# EAGLE design 8-Bit Register (EAGLE 7.5.0)
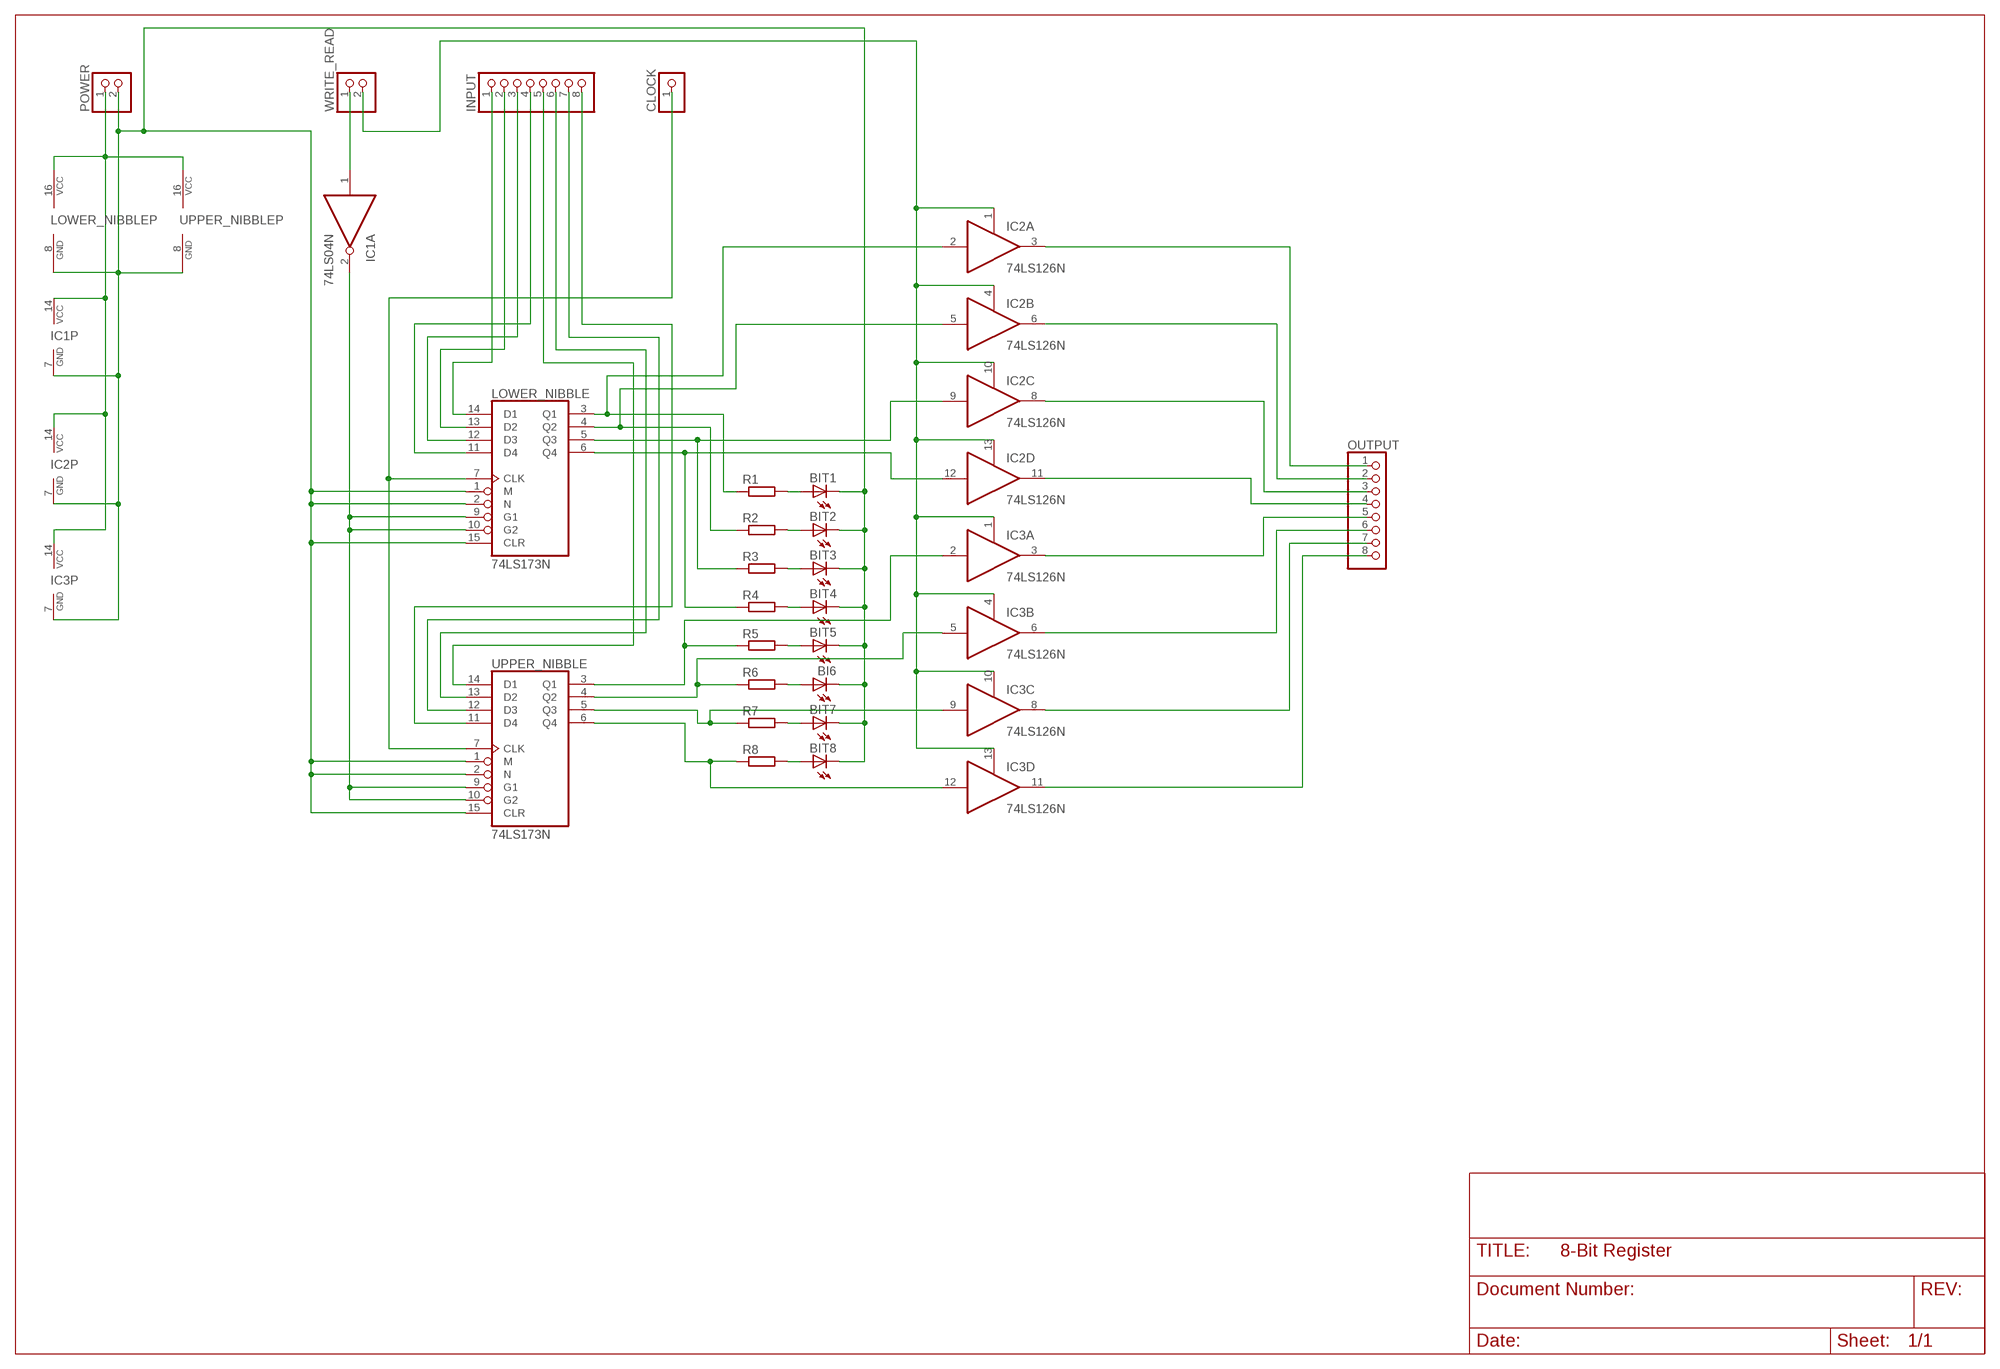
[diagram p0: schematic, sheet 1]

## Parts
BI6  LED3MM  [LED3MM]
BIT1  LED3MM  [LED3MM]
BIT2  LED3MM  [LED3MM]
BIT3  LED3MM  [LED3MM]
BIT4  LED3MM  [LED3MM]
BIT5  LED3MM  [LED3MM]
BIT7  LED3MM  [LED3MM]
BIT8  LED3MM  [LED3MM]
CLOCK  PINHD-1X1  [1X01]
IC1  74LS04N  [DIL14]
IC2  74LS126N  [DIL14]
IC3  74LS126N  [DIL14]
INPUT  PINHD-1X8  [1X08]
LOWER_NIBBLE  74LS173N  [DIL16]
OUTPUT  PINHD-1X8  [1X08]
POWER  PINHD-1X2  [1X02]
R1  R-EU_0207/10  [0207/10]
R2  R-EU_0207/10  [0207/10]
R3  R-EU_0207/10  [0207/10]
R4  R-EU_0207/10  [0207/10]
R5  R-EU_0207/10  [0207/10]
R6  R-EU_0207/10  [0207/10]
R7  R-EU_0207/10  [0207/10]
R8  R-EU_0207/10  [0207/10]
UPPER_NIBBLE  74LS173N  [DIL16]
WRITE_READ  PINHD-1X2  [1X02]

## Nets
GND: BI6.K(C) BIT1.K(C) BIT2.K(C) BIT3.K(C) BIT4.K(C) BIT5.K(C) BIT7.K(C) BIT8.K(C) IC1.7(P:GND) IC2.7(P:GND) IC3.7(P:GND) LOWER_NIBBLE.1(M) LOWER_NIBBLE.2(N) LOWER_NIBBLE.8(GND) LOWER_NIBBLE.15(CLR) POWER.2 UPPER_NIBBLE.1(M) UPPER_NIBBLE.2(N) UPPER_NIBBLE.8(GND) UPPER_NIBBLE.15(CLR)
N$1: BIT8.A R8.2
N$2: IC1.1(A:I) WRITE_READ.1
N$3: BIT1.A R1.2
N$5: BIT2.A R2.2
N$6: BIT3.A R3.2
N$7: BIT4.A R4.2
N$8: BIT5.A R5.2
N$9: BI6.A R6.2
N$10: BIT7.A R7.2
N$11: IC2.11(D:O) OUTPUT.4
N$12: IC1.2(A:O) LOWER_NIBBLE.9(G1) LOWER_NIBBLE.10(G2) UPPER_NIBBLE.9(G1) UPPER_NIBBLE.10(G2)
N$13: CLOCK.1 LOWER_NIBBLE.7(CLK) UPPER_NIBBLE.7(CLK)
N$14: INPUT.1 LOWER_NIBBLE.14(D1)
N$15: INPUT.2 LOWER_NIBBLE.13(D2)
N$16: INPUT.3 LOWER_NIBBLE.12(D3)
N$17: INPUT.4 LOWER_NIBBLE.11(D4)
N$18: INPUT.6 UPPER_NIBBLE.13(D2)
N$19: INPUT.5 UPPER_NIBBLE.14(D1)
N$20: INPUT.7 UPPER_NIBBLE.12(D3)
N$21: INPUT.8 UPPER_NIBBLE.11(D4)
N$22: IC2.2(A:I) LOWER_NIBBLE.3(Q1) R1.1
N$23: IC2.5(B:I) LOWER_NIBBLE.4(Q2) R2.1
N$24: IC2.9(C:I) LOWER_NIBBLE.5(Q3) R3.1
N$25: IC2.12(D:I) LOWER_NIBBLE.6(Q4) R4.1
N$26: IC3.2(A:I) R5.1 UPPER_NIBBLE.3(Q1)
N$27: IC3.5(B:I) R6.1 UPPER_NIBBLE.4(Q2)
N$28: IC3.9(C:I) R7.1 UPPER_NIBBLE.5(Q3)
N$29: IC3.12(D:I) R8.1 UPPER_NIBBLE.6(Q4)
N$30: IC2.1(A:OE) IC2.4(B:OE) IC2.10(C:OE) IC2.13(D:OE) IC3.1(A:OE) IC3.4(B:OE) IC3.10(C:OE) IC3.13(D:OE) WRITE_READ.2
N$31: IC2.3(A:O) OUTPUT.1
N$32: IC2.6(B:O) OUTPUT.2
N$33: IC2.8(C:O) OUTPUT.3
N$35: IC3.3(A:O) OUTPUT.5
N$36: IC3.6(B:O) OUTPUT.6
N$37: IC3.8(C:O) OUTPUT.7
N$38: IC3.11(D:O) OUTPUT.8
VCC: IC1.14(P:VCC) IC2.14(P:VCC) IC3.14(P:VCC) LOWER_NIBBLE.16(VCC) POWER.1 UPPER_NIBBLE.16(VCC)
Unconnected: IC1.3(B:I) IC1.4(B:O) IC1.5(C:I) IC1.6(C:O) IC1.8(D:O) IC1.9(D:I) IC1.10(E:O) IC1.11(E:I) IC1.12(F:O) IC1.13(F:I)

## Library data of the parts
BI6 BIT1-BIT5 BIT7 BIT8 = led:LED: LED OSRAM: - CHIPLED LG R971, LG N971, LY N971, LG Q971, LY Q971, LO R971, LY R971 LH N974, LH R974 LS Q976, LO Q976, LY Q976 LO Q996 - Hyper CHIPLED LW Q18S LB Q993, LB Q99A, LB R99A - SideLED LS A670, LO A670, LY A670, LG A670, LP A670 LB A673, LV A673, LT A673, LW A673 LH A674 LY A675 LS A676, LA A676, LO A676, LY A676, LW A676 LS A679, LY A679, LG A679 - Hyper Micro SIDELED® LS Y876, LA Y876, LO Y876, LY Y876 LT Y87S - SmartLED LW L88C, LW L88S LB L89C, LB L89S, LG L890 LS L89K, LO L89K, LY L89K LS L896, LA L896, LO L896, LY L896 - TOPLED LS T670, LO T670, LY T670, LG T670, LP T670 LSG T670, LSP T670, LSY T670, LOP T670, LYG T670 LG T671, LOG T671, LSG T671 LB T673, LV T673, LT T673, LW T673 LH T674 LS T676, LA T676, LO T676, LY T676, LB T676, LH T676, LSB T676, LW T676 LB T67C, LV T67C, LT T67C, LS T67K, LO T67K, LY T67K, LW E67C LS E67B, LA E67B, LO E67B, LY E67B, LB E67C, LV E67C, LT E67C LW T67C LS T679, LY T679, LG T679 LS T770, LO T770, LY T770, LG T770, LP T770 LB T773, LV T773, LT T773, LW T773 LH T774 LS E675, LA E675, LY E675, LS T675 LS T776, LA T776, LO T776, LY T776, LB T776 LHGB T686 LT T68C, LB T68C - Hyper Mini TOPLED® LB M676 - Mini TOPLED Santana® LG M470 LS M47K, LO M47K, LY M47K Source: http://www.osram.convergy.de LUXEON: - LUMILED® LXK2-PW12-R00, LXK2-PW12-S00, LXK2-PW14-U00, LXK2-PW14-V00 LXK2-PM12-R00, LXK2-PM12-S00, LXK2-PM14-U00 LXK2-PE12-Q00, LXK2-PE12-R00, LXK2-PE12-S00, LXK2-PE14-T00, LXK2-PE14-U00 LXK2-PB12-K00, LXK2-PB12-L00, LXK2-PB12-M00, LXK2-PB14-N00, LXK2-PB14-P00, LXK2-PB14-Q00 LXK2-PR12-L00, LXK2-PR12-M00, LXK2-PR14-Q00, LXK2-PR14-R00 LXK2-PD12-Q00, LXK2-PD12-R00, LXK2-PD12-S00 LXK2-PH12-R00, LXK2-PH12-S00 LXK2-PL12-P00, LXK2-PL12-Q00, LXK2-PL12-R00 Source: www.luxeon.com KINGBRIGHT: KA-3528ASYC Source: www.kingbright.com
CLOCK = pinhead:PINHD-1X1: PIN HEADER
IC1 = 74xx-eu:74*04: Hex INVERTER
IC2 IC3 = 74xx-eu:74*126: Quad bus BUFFER, 3-state
INPUT OUTPUT = pinhead:PINHD-1X8: PIN HEADER
LOWER_NIBBLE UPPER_NIBBLE = 74xx-us:74*173: 4-bit D type REGISTER, 3-state
POWER WRITE_READ = pinhead:PINHD-1X2: PIN HEADER
R1-R8 = resistor:R-EU_: RESISTOR, European symbol

## Board
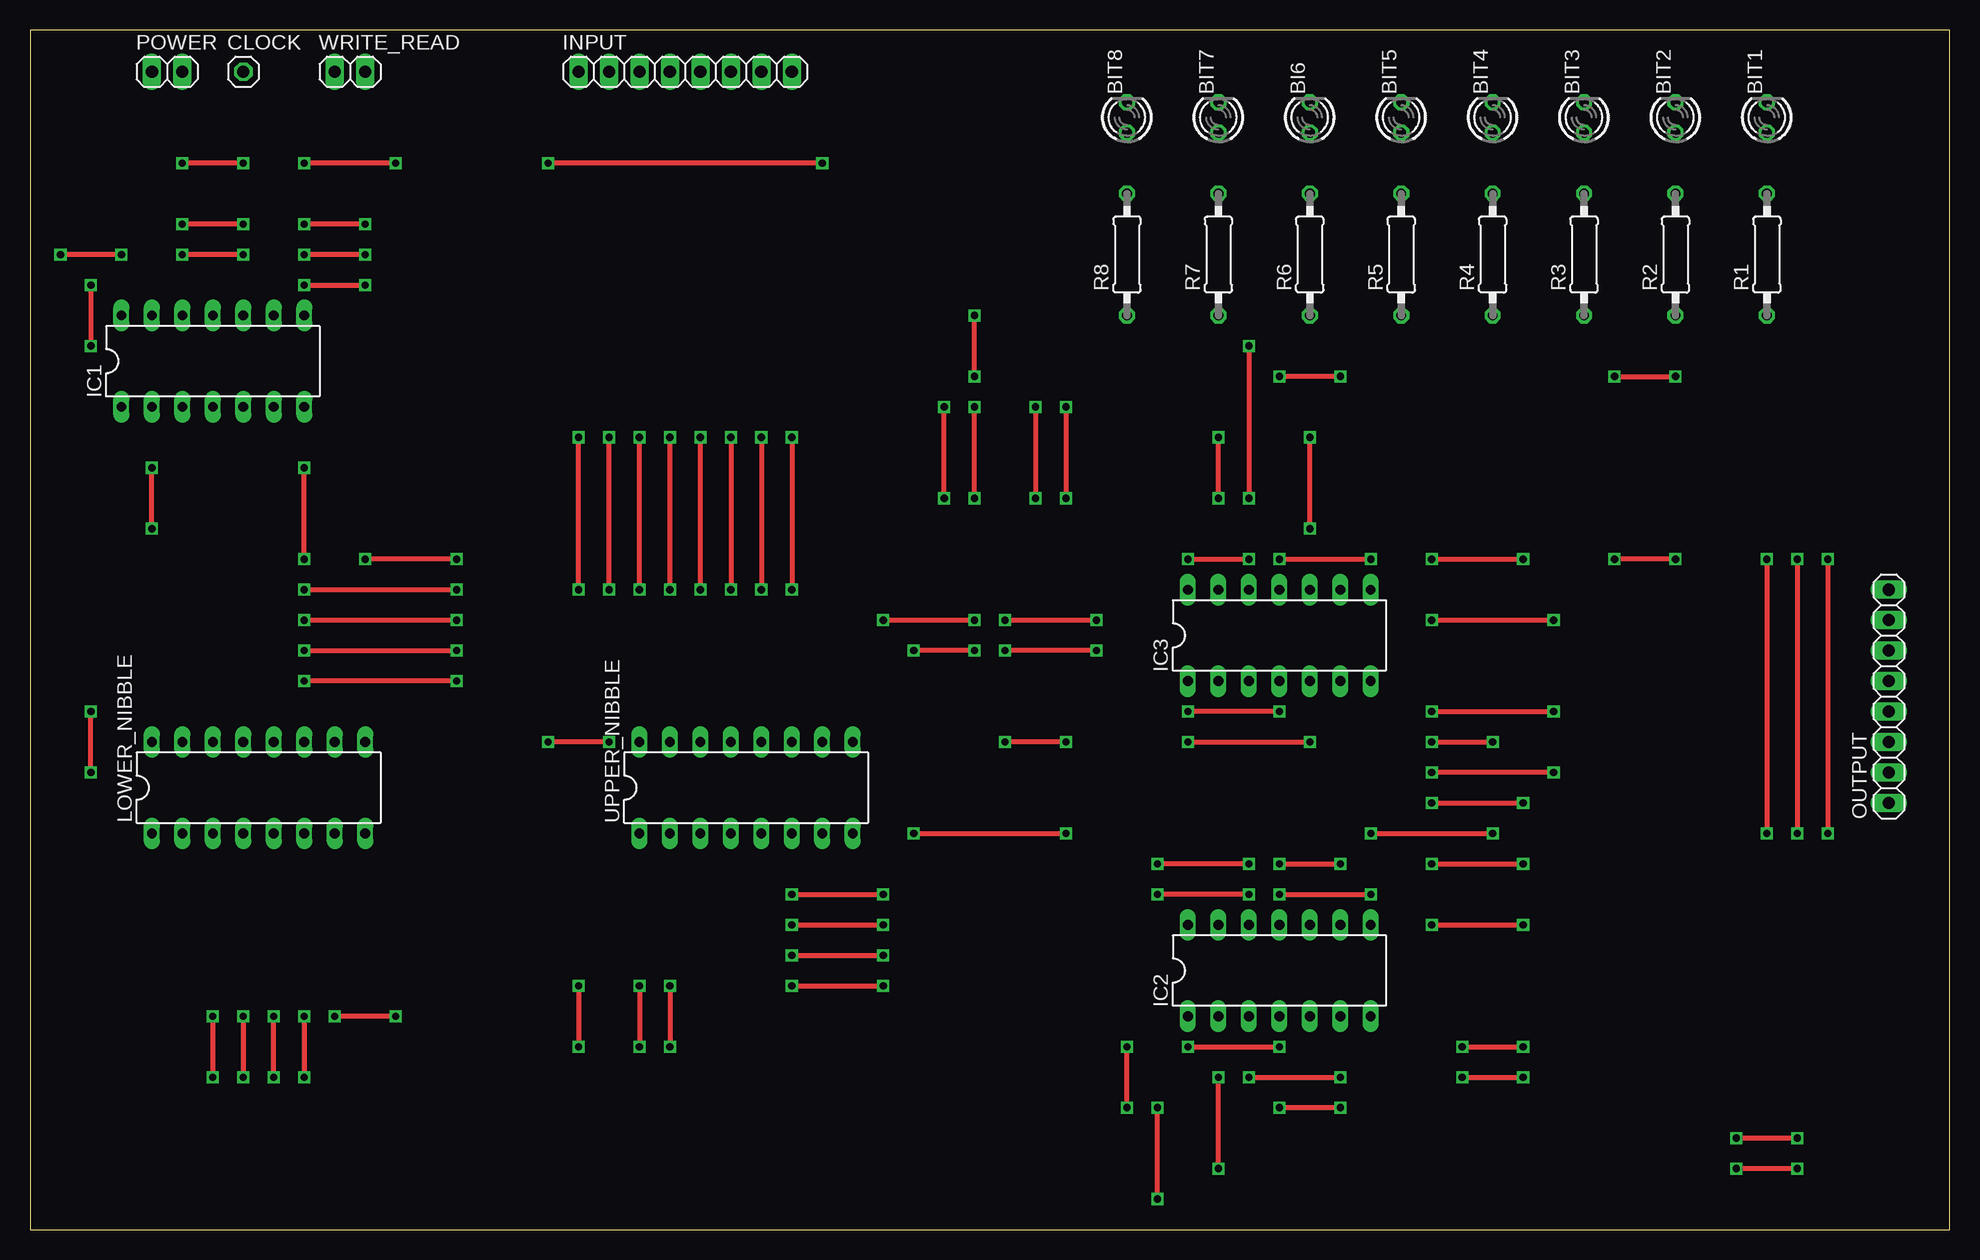
[diagram p1: board, top side]
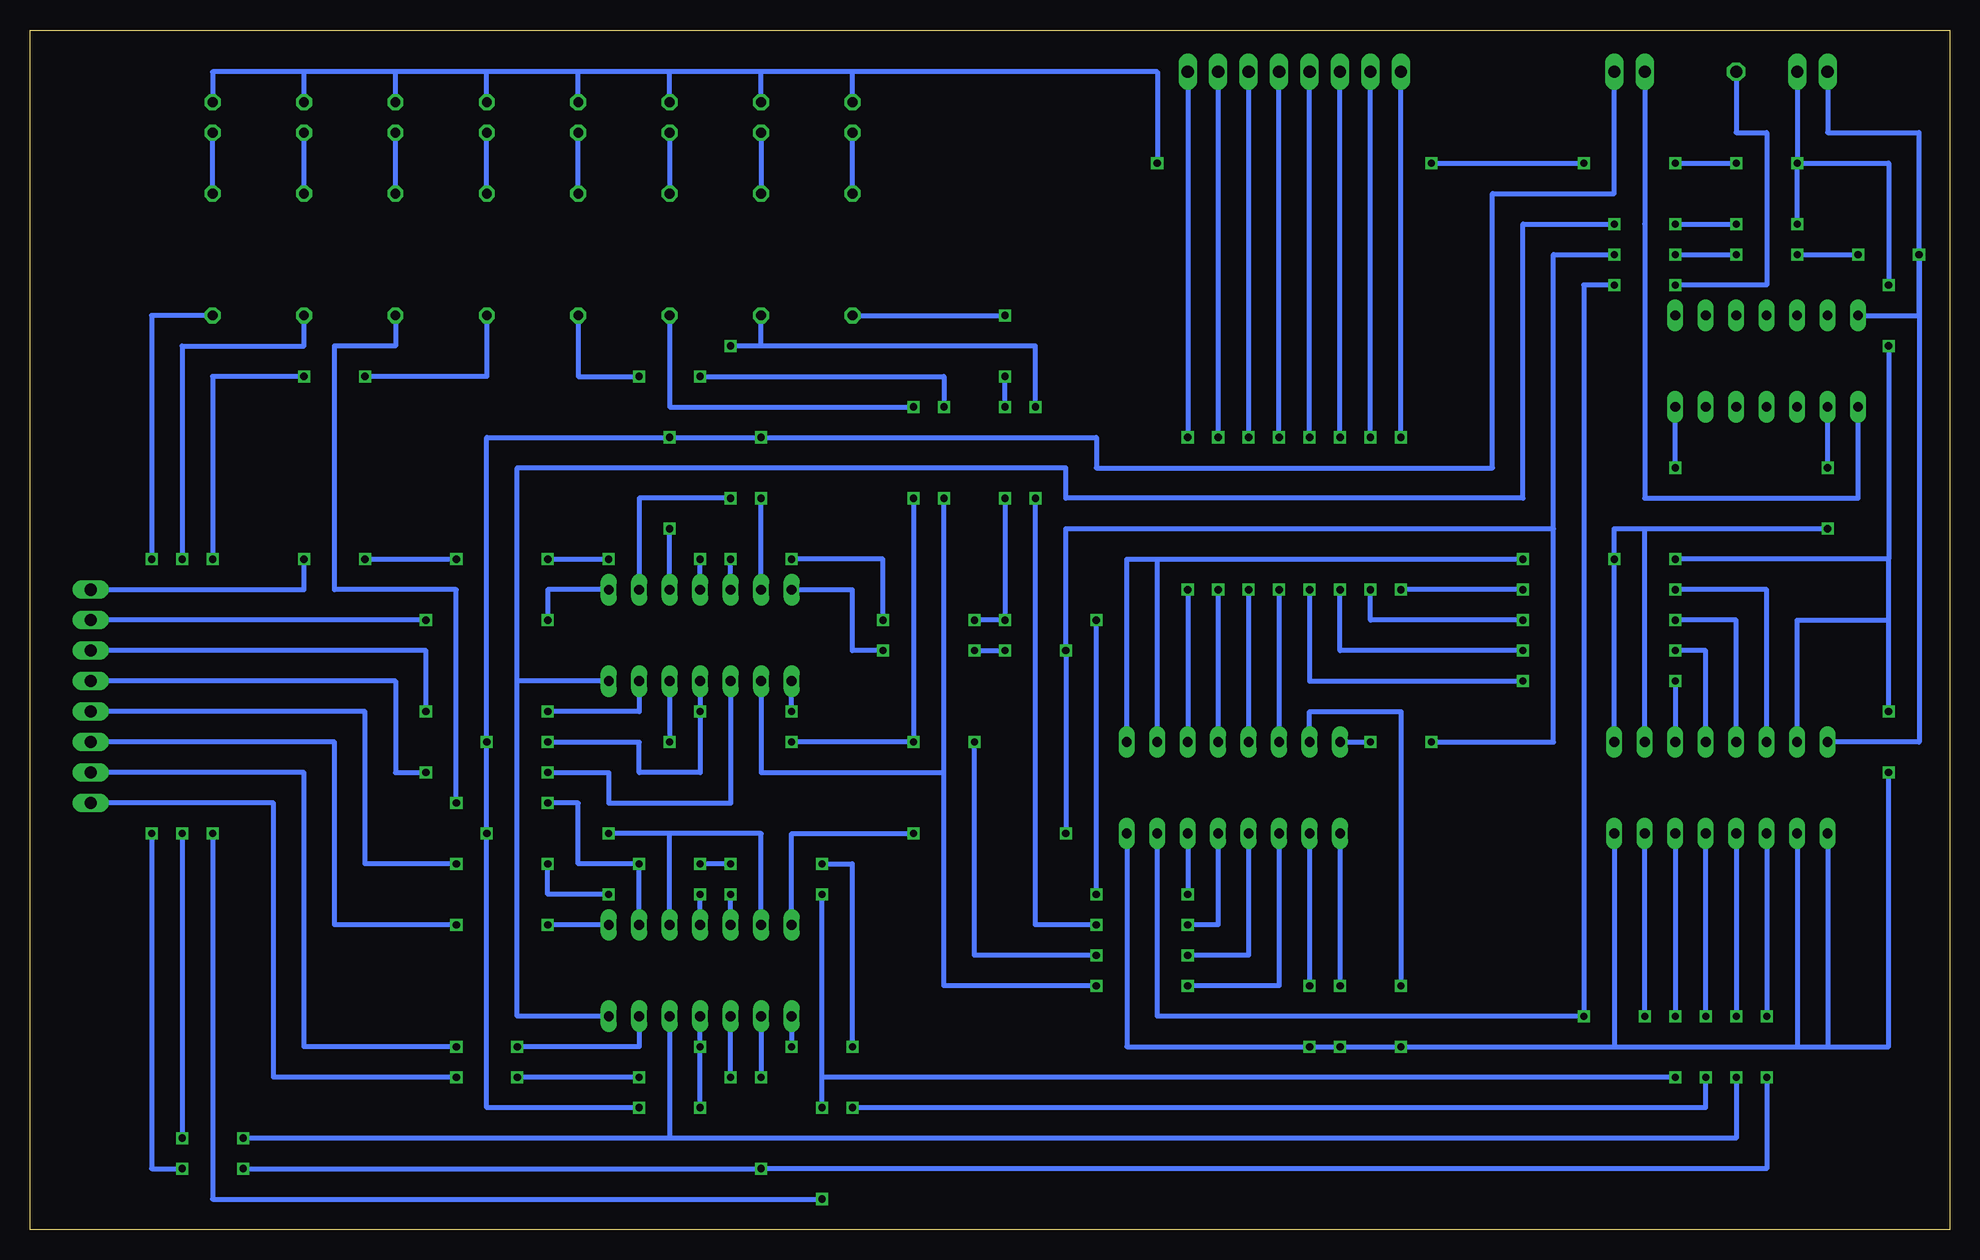
[diagram p2: board, bottom side, seen from below]

Size 160 x 100 mm. Coordinates in mm from the lower left corner, seen from the top.
Outline: 0,0 160,0 160,100 0,100 0,0
Copper layers (1*16): Top 0.035mm / dielectric 1.5mm / Bottom 0.035mm
Design rules "default": minimum track width 10mil, minimum drill 24mil, track to track 8mil, track to pad 8mil, pad to pad 8mil, via to via 8mil, smd to smd 8mil, copper to edge 40mil, drill to drill 8mil, minimum pad ring 10mil, minimum via ring 8mil, stop-mask expansion 4mil, vias tented up to drill 0mil, thermal gap 10mil

### Footprints (pad centres in the part's own frame; a part is rotated, then mirrored left to right if it is on the bottom)
LED3MM = drill 0.813 octagon: A -1.27,0; K 1.27,0
1X01 = drill 1.016 octagon: 1 0,0
DIL14 = drill 0.813 long: 1 -7.62,-3.81; 2 -5.08,-3.81; 3 -2.54,-3.81; 4 0,-3.81; 5 2.54,-3.81; 6 5.08,-3.81; 7 7.62,-3.81; 8 7.62,3.81; 9 5.08,3.81; 10 2.54,3.81; 11 0,3.81; 12 -2.54,3.81; 13 -5.08,3.81; 14 -7.62,3.81
1X08 = drill 1.016 long: 1 -8.89,0; 2 -6.35,0; 3 -3.81,0; 4 -1.27,0; 5 1.27,0; 6 3.81,0; 7 6.35,0; 8 8.89,0
DIL16 = drill 0.813 long: 1 -8.89,-3.81; 2 -6.35,-3.81; 3 -3.81,-3.81; 4 -1.27,-3.81; 5 1.27,-3.81; 6 3.81,-3.81; 7 6.35,-3.81; 8 8.89,-3.81; 9 8.89,3.81; 10 6.35,3.81; 11 3.81,3.81; 12 1.27,3.81; 13 -1.27,3.81; 14 -3.81,3.81; 15 -6.35,3.81; 16 -8.89,3.81
1X02 = drill 1.016 long: 1 -1.27,0; 2 1.27,0
0207/10 = drill 0.813 octagon: 1 -5.08,0; 2 5.08,0

### Placement (x,y rotation side)
BI6  106.68,92.71 90 top
BIT1  144.78,92.71 90 top
BIT2  137.16,92.71 90 top
BIT3  129.54,92.71 90 top
BIT4  121.92,92.71 90 top
BIT5  114.3,92.71 90 top
BIT7  99.06,92.71 90 top
BIT8  91.44,92.71 90 top
CLOCK  17.78,96.52 0 top
IC1  15.24,72.39 0 top
IC2  104.14,21.59 0 top
IC3  104.14,49.53 0 top
INPUT  54.61,96.52 0 top
LOWER_NIBBLE  19.05,36.83 0 top
OUTPUT  154.94,44.45 90 top
POWER  11.43,96.52 0 top
R1  144.78,81.28 90 top
R2  137.16,81.28 90 top
R3  129.54,81.28 90 top
R4  121.92,81.28 90 top
R5  114.3,81.28 90 top
R6  106.68,81.28 90 top
R7  99.06,81.28 90 top
R8  91.44,81.28 90 top
UPPER_NIBBLE  59.69,36.83 0 top
WRITE_READ  26.67,96.52 0 top

### Tracks (layer width: path | path; a pad name or v marks a point on that pad's centre or on a via)
GND  (via drill 0.6)
  Top 0.406: v5.08,78.74 v5.08,73.66 | v22.86,55.88 v22.86,63.5 | v5.08,38.1 v5.08,43.18 | v45.72,20.32 v45.72,15.24 | v50.8,20.32 v50.8,15.24 | v53.34,20.32 v53.34,15.24 | v27.94,83.82 v22.86,83.82 | v17.78,83.82 v12.7,83.82 | v30.48,88.9 v22.86,88.9 | v17.78,88.9 v12.7,88.9 | v66.04,88.9 v43.18,88.9
  Bottom 0.406: POWER.2 v12.7,88.9 | v12.7,88.9 5.08,88.9 v5.08,78.74 | v5.08,73.66 5.08,55.88 | 5.08,55.88 v22.86,55.88 | v22.86,63.5 IC1.7 | LOWER_NIBBLE.8 27.94,15.24 | 27.94,15.24 12.7,15.24 | 12.7,15.24 10.16,15.24 | 10.16,15.24 5.08,15.24 v5.08,38.1 | v5.08,43.18 5.08,50.8 | 5.08,50.8 5.08,55.88 | LOWER_NIBBLE.1 10.16,15.24 | LOWER_NIBBLE.2 12.7,15.24 | UPPER_NIBBLE.8 68.58,15.24 v53.34,15.24 v50.8,15.24 v45.72,15.24 27.94,15.24 | v45.72,20.32 45.72,43.18 53.34,43.18 UPPER_NIBBLE.15 | UPPER_NIBBLE.1 v50.8,20.32 | UPPER_NIBBLE.2 v53.34,20.32 | LOWER_NIBBLE.15 12.7,50.8 5.08,50.8 | v27.94,83.82 35.56,83.82 35.56,60.96 73.66,60.96 73.66,63.5 119.38,63.5 119.38,45.72 | v22.86,83.82 v17.78,83.82 | v12.7,83.82 v12.7,88.9 | 119.38,45.72 119.38,17.78 IC2.7 | v43.18,88.9 v30.48,88.9 | v22.86,88.9 v17.78,88.9 | v66.04,88.9 66.04,96.52 91.44,96.52 | 91.44,96.52 99.06,96.52 | 99.06,96.52 106.68,96.52 | 106.68,96.52 114.3,96.52 | 114.3,96.52 121.92,96.52 | 121.92,96.52 129.54,96.52 | 129.54,96.52 137.16,96.52 | 137.16,96.52 144.78,96.52 BIT1.K | BIT8.K 91.44,96.52 | BIT7.K 99.06,96.52 | BI6.K 106.68,96.52 | BIT5.K 114.3,96.52 | BIT4.K 121.92,96.52 | BIT3.K 129.54,96.52 | BIT2.K 137.16,96.52 | IC3.7 119.38,45.72
N$1
  Bottom 0.406: R8.2 BIT8.A
N$2
  Bottom 0.406: WRITE_READ.1 25.4,83.82 25.4,60.96 7.62,60.96 IC1.1
N$3
  Bottom 0.406: R1.2 BIT1.A
N$5
  Bottom 0.406: R2.2 BIT2.A
N$6
  Bottom 0.406: R3.2 BIT3.A
N$7
  Bottom 0.406: R4.2 BIT4.A
N$8
  Bottom 0.406: R5.2 BIT5.A
N$9
  Bottom 0.406: BI6.A R6.2
N$10
  Bottom 0.406: BIT7.A R7.2
N$11  (via drill 0.6)
  Top 0.406: v104.14,27.94 v111.76,27.94 | v116.84,30.48 v124.46,30.48
  Bottom 0.406: IC2.11 v104.14,27.94 | v111.76,27.94 116.84,27.94 v116.84,30.48 | v124.46,30.48 132.08,30.48 132.08,43.18 OUTPUT.4
N$12  (via drill 0.6)
  Top 0.406: v35.56,55.88 v27.94,55.88 | v10.16,58.42 v10.16,63.5
  Bottom 0.406: UPPER_NIBBLE.10 66.04,55.88 | 66.04,55.88 v35.56,55.88 | 25.4,58.42 v10.16,58.42 | v10.16,63.5 IC1.2 | LOWER_NIBBLE.9 v27.94,55.88 27.94,58.42 25.4,58.42 | LOWER_NIBBLE.10 25.4,58.42 | UPPER_NIBBLE.9 68.58,55.88 66.04,55.88
N$13  (via drill 0.6)
  Top 0.406: v22.86,78.74 v27.94,78.74 | v30.48,17.78 v25.4,17.78
  Bottom 0.406: v22.86,78.74 15.24,78.74 15.24,91.44 17.78,91.44 CLOCK.1 | v27.94,78.74 30.48,78.74 v30.48,17.78 66.04,17.78 UPPER_NIBBLE.7 | v25.4,17.78 LOWER_NIBBLE.7
N$14  (via drill 0.6)
  Top 0.406: v22.86,53.34 v35.56,53.34 | v45.72,53.34 v45.72,66.04
  Bottom 0.406: LOWER_NIBBLE.14 15.24,53.34 v22.86,53.34 | v35.56,53.34 v45.72,53.34 | v45.72,66.04 INPUT.1
N$15  (via drill 0.6)
  Top 0.406: v22.86,50.8 v35.56,50.8 | v48.26,53.34 v48.26,66.04
  Bottom 0.406: LOWER_NIBBLE.13 17.78,50.8 v22.86,50.8 | v35.56,50.8 48.26,50.8 v48.26,53.34 | v48.26,66.04 INPUT.2
N$16  (via drill 0.6)
  Top 0.406: v22.86,48.26 v35.56,48.26 | v50.8,53.34 v50.8,66.04
  Bottom 0.406: LOWER_NIBBLE.12 20.32,48.26 v22.86,48.26 | v35.56,48.26 50.8,48.26 v50.8,53.34 | v50.8,66.04 INPUT.3
N$17  (via drill 0.6)
  Top 0.406: v35.56,45.72 v22.86,45.72 | v53.34,53.34 v53.34,66.04
  Bottom 0.406: v35.56,45.72 53.34,45.72 v53.34,53.34 | v22.86,45.72 LOWER_NIBBLE.11 | v53.34,66.04 INPUT.4
N$18  (via drill 0.6)
  Top 0.406: v58.42,66.04 v58.42,53.34
  Bottom 0.406: INPUT.6 v58.42,66.04 | v58.42,53.34 UPPER_NIBBLE.13
N$19  (via drill 0.6)
  Top 0.406: v55.88,53.34 v55.88,66.04
  Bottom 0.406: v55.88,53.34 UPPER_NIBBLE.14 | v55.88,66.04 INPUT.5
N$20  (via drill 0.6)
  Top 0.406: v60.96,66.04 v60.96,53.34
  Bottom 0.406: v60.96,53.34 UPPER_NIBBLE.12 | INPUT.7 v60.96,66.04
N$21  (via drill 0.6)
  Top 0.406: v63.5,66.04 v63.5,53.34
  Bottom 0.406: INPUT.8 v63.5,66.04 | v63.5,53.34 UPPER_NIBBLE.11
N$22  (via drill 0.6)
  Top 0.406: v15.24,17.78 v15.24,12.7 | v99.06,5.08 v99.06,12.7 | v149.86,55.88 v149.86,33.02 | v147.32,5.08 v142.24,5.08
  Bottom 0.406: LOWER_NIBBLE.3 v15.24,17.78 | v15.24,12.7 15.24,5.08 v99.06,5.08 v142.24,5.08 | v149.86,33.02 149.86,5.08 v147.32,5.08 | R1.1 149.86,76.2 v149.86,55.88 | IC2.2 v99.06,12.7
N$23  (via drill 0.6)
  Top 0.406: v17.78,17.78 v17.78,12.7 | v147.32,55.88 v147.32,33.02 | v147.32,7.62 v142.24,7.62
  Bottom 0.406: LOWER_NIBBLE.4 v17.78,17.78 | v17.78,12.7 17.78,7.62 106.68,7.62 | 106.68,7.62 v142.24,7.62 | v147.32,33.02 v147.32,7.62 | v147.32,55.88 147.32,73.66 137.16,73.66 R2.1 | IC2.5 106.68,7.62
N$24  (via drill 0.6)
  Top 0.406: v91.44,10.16 v91.44,15.24 | v101.6,30.48 v93.98,30.48 | v116.84,35.56 v124.46,35.56 | v20.32,12.7 v20.32,17.78 | v104.14,30.48 v109.22,30.48
  Bottom 0.406: v91.44,10.16 20.32,10.16 v20.32,12.7 | v91.44,15.24 91.44,30.48 v93.98,30.48 | R3.1 129.54,73.66 134.62,73.66 134.62,53.34 124.46,53.34 v124.46,35.56 | v20.32,17.78 LOWER_NIBBLE.5 | IC2.9 v109.22,30.48 114.3,30.48 114.3,35.56 v116.84,35.56 | v101.6,30.48 v104.14,30.48
N$25  (via drill 0.6)
  Top 0.406: v22.86,17.78 v22.86,12.7 | v144.78,55.88 v144.78,33.02 | v93.98,2.54 v93.98,10.16 | v101.6,27.94 v93.98,27.94 | v132.08,71.12 v137.16,71.12
  Bottom 0.406: LOWER_NIBBLE.6 v22.86,17.78 | v22.86,12.7 93.98,12.7 | 93.98,12.7 v93.98,27.94 | v144.78,33.02 144.78,2.54 v93.98,2.54 | v93.98,10.16 93.98,12.7 | R4.1 121.92,71.12 v132.08,71.12 | v137.16,71.12 144.78,71.12 v144.78,55.88 | IC2.12 v101.6,27.94
N$26  (via drill 0.6)
  Top 0.406: v63.5,20.32 v71.12,20.32 | v83.82,68.58 v83.82,60.96 | v109.22,71.12 v104.14,71.12
  Bottom 0.406: UPPER_NIBBLE.3 55.88,20.32 v63.5,20.32 | R5.1 114.3,71.12 v109.22,71.12 | v104.14,71.12 83.82,71.12 v83.82,68.58 | v71.12,20.32 83.82,20.32 83.82,38.1 | 83.82,38.1 v83.82,60.96 | IC3.2 99.06,38.1 83.82,38.1
N$27  (via drill 0.6)
  Top 0.406: v86.36,68.58 v86.36,60.96 | v96.52,40.64 v106.68,40.64 | v63.5,22.86 v71.12,22.86 | v86.36,40.64 v81.28,40.64
  Bottom 0.406: v86.36,60.96 v86.36,40.64 v96.52,40.64 | UPPER_NIBBLE.4 58.42,22.86 v63.5,22.86 | v71.12,22.86 81.28,22.86 v81.28,40.64 | R6.1 106.68,68.58 v86.36,68.58 | IC3.5 v106.68,40.64
N$28  (via drill 0.6)
  Top 0.406: v63.5,25.4 v71.12,25.4 | v76.2,60.96 v76.2,68.58 | v101.6,73.66 v101.6,60.96
  Bottom 0.406: UPPER_NIBBLE.5 60.96,25.4 v63.5,25.4 | v71.12,25.4 76.2,25.4 v76.2,60.96 | v76.2,68.58 76.2,73.66 99.06,73.66 | 99.06,73.66 R7.1 | 99.06,73.66 v101.6,73.66 | v101.6,60.96 109.22,60.96 IC3.9
N$29  (via drill 0.6)
  Top 0.406: v63.5,27.94 v71.12,27.94 | v71.12,50.8 v78.74,50.8 | v81.28,50.8 v88.9,50.8 | v96.52,55.88 v101.6,55.88 | v78.74,60.96 v78.74,68.58 | v78.74,71.12 v78.74,76.2
  Bottom 0.406: UPPER_NIBBLE.6 v63.5,27.94 | v71.12,27.94 v71.12,50.8 | v81.28,50.8 v78.74,50.8 v78.74,60.96 | v88.9,50.8 88.9,55.88 v96.52,55.88 | R8.1 v78.74,76.2 | IC3.12 v101.6,55.88 | v78.74,68.58 v78.74,71.12
N$30  (via drill 0.6)
  Top 0.406: v99.06,60.96 v99.06,66.04 | v111.76,33.02 v121.92,33.02 | v116.84,40.64 v121.92,40.64 | v106.68,58.42 v106.68,66.04 | v104.14,43.18 v96.52,43.18 | v96.52,15.24 v104.14,15.24 | v109.22,10.16 v104.14,10.16
  Bottom 0.406: WRITE_READ.2 27.94,86.36 38.1,86.36 38.1,63.5 71.12,63.5 71.12,66.04 v99.06,66.04 v106.68,66.04 121.92,66.04 v121.92,40.64 v121.92,33.02 121.92,10.16 v109.22,10.16 | 106.68,33.02 99.06,33.02 IC2.13 | 106.68,33.02 v111.76,33.02 | v116.84,40.64 109.22,40.64 109.22,38.1 104.14,38.1 v104.14,43.18 IC3.4 | IC3.10 v106.68,58.42 | IC3.13 v99.06,60.96 | v96.52,43.18 IC3.1 | IC2.1 v96.52,15.24 | IC2.4 v104.14,15.24 v104.14,10.16 | IC2.10 106.68,33.02
N$31  (via drill 0.6)
  Top 0.406: v101.6,12.7 v109.22,12.7 | v119.38,12.7 v124.46,12.7
  Bottom 0.406: v109.22,12.7 v119.38,12.7 | v124.46,12.7 139.7,12.7 139.7,35.56 OUTPUT.1 | v101.6,12.7 IC2.3
N$32  (via drill 0.6)
  Top 0.406: v119.38,15.24 v124.46,15.24
  Bottom 0.406: v119.38,15.24 109.22,15.24 IC2.6 | OUTPUT.2 137.16,38.1 137.16,15.24 v124.46,15.24
N$33  (via drill 0.6)
  Top 0.406: v116.84,25.4 v124.46,25.4
  Bottom 0.406: v124.46,25.4 134.62,25.4 134.62,40.64 OUTPUT.3 | IC2.8 v116.84,25.4
N$35  (via drill 0.6)
  Top 0.406: v127,38.1 v116.84,38.1
  Bottom 0.406: OUTPUT.5 129.54,45.72 129.54,38.1 v127,38.1 | IC3.3 101.6,35.56 111.76,35.56 111.76,38.1 v116.84,38.1
N$36  (via drill 0.6)
  Top 0.406: v116.84,43.18 v127,43.18
  Bottom 0.406: v116.84,43.18 109.22,43.18 IC3.6 | v127,43.18 127,48.26 OUTPUT.6
N$37  (via drill 0.6)
  Top 0.406: v116.84,50.8 v127,50.8
  Bottom 0.406: v127,50.8 OUTPUT.7 | v116.84,50.8 116.84,53.34 IC3.8
N$38  (via drill 0.6)
  Top 0.406: v116.84,55.88 v124.46,55.88 | v137.16,55.88 v132.08,55.88 | v104.14,55.88 v111.76,55.88
  Bottom 0.406: v116.84,55.88 v111.76,55.88 | OUTPUT.8 137.16,53.34 v137.16,55.88 | v132.08,55.88 v124.46,55.88 | IC3.11 v104.14,55.88
VCC  (via drill 0.6)
  Top 0.406: v48.26,40.64 v43.18,40.64 | v27.94,81.28 v22.86,81.28 | v17.78,81.28 v12.7,81.28 | v7.62,81.28 v2.54,81.28 | v73.66,33.02 v86.36,33.02 | v88.9,48.26 v81.28,48.26 | v78.74,48.26 v73.66,48.26
  Bottom 0.406: POWER.1 10.16,91.44 2.54,91.44 v2.54,81.28 | v2.54,81.28 2.54,76.2 IC1.14 | v2.54,81.28 2.54,40.64 LOWER_NIBBLE.16 | UPPER_NIBBLE.16 v48.26,40.64 | v43.18,40.64 33.02,40.64 33.02,58.42 | 33.02,58.42 33.02,81.28 v27.94,81.28 | v22.86,81.28 v17.78,81.28 | v12.7,81.28 v7.62,81.28 | v73.66,33.02 v73.66,48.26 73.66,58.42 33.02,58.42 | v81.28,48.26 v78.74,48.26 | v88.9,48.26 91.44,48.26 91.44,53.34 IC3.14 | IC2.14 96.52,33.02 v86.36,33.02